# Altium schematic sheet 28pins_schematic.SchDoc (part 1 of 3)
size A2
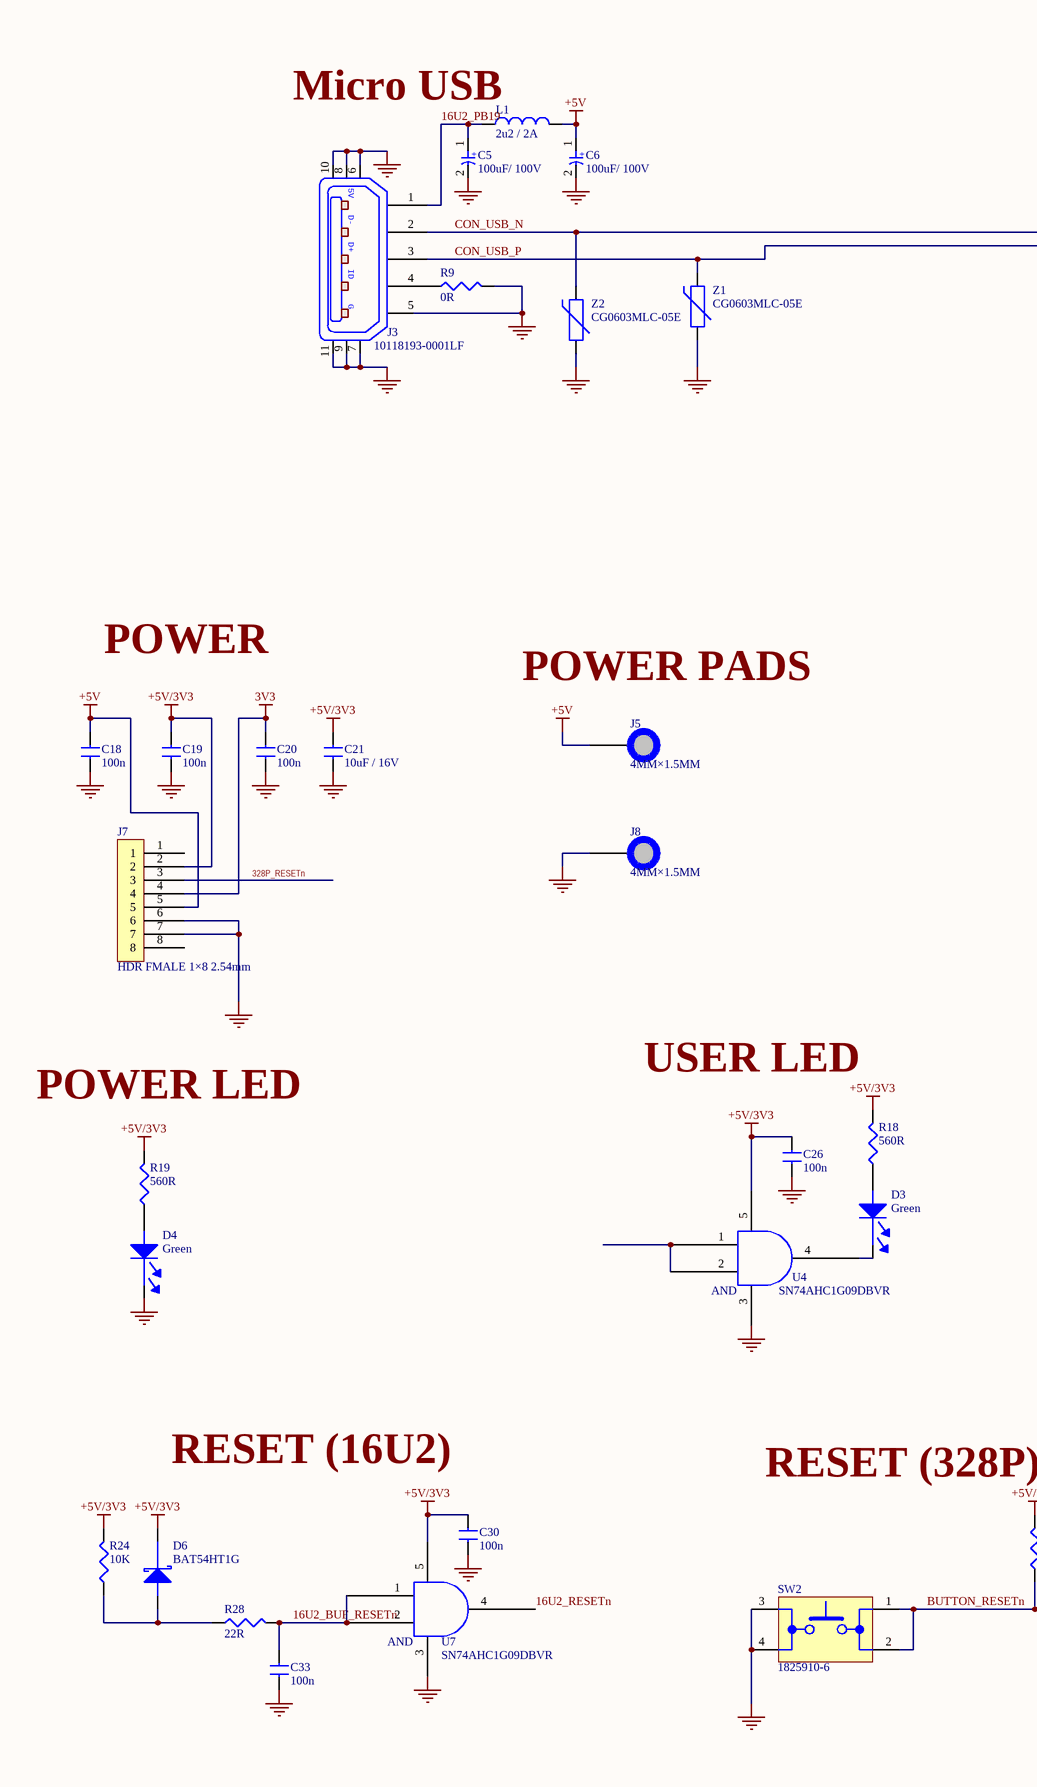
[diagram p0: 28pins_schematic.SchDoc, left]
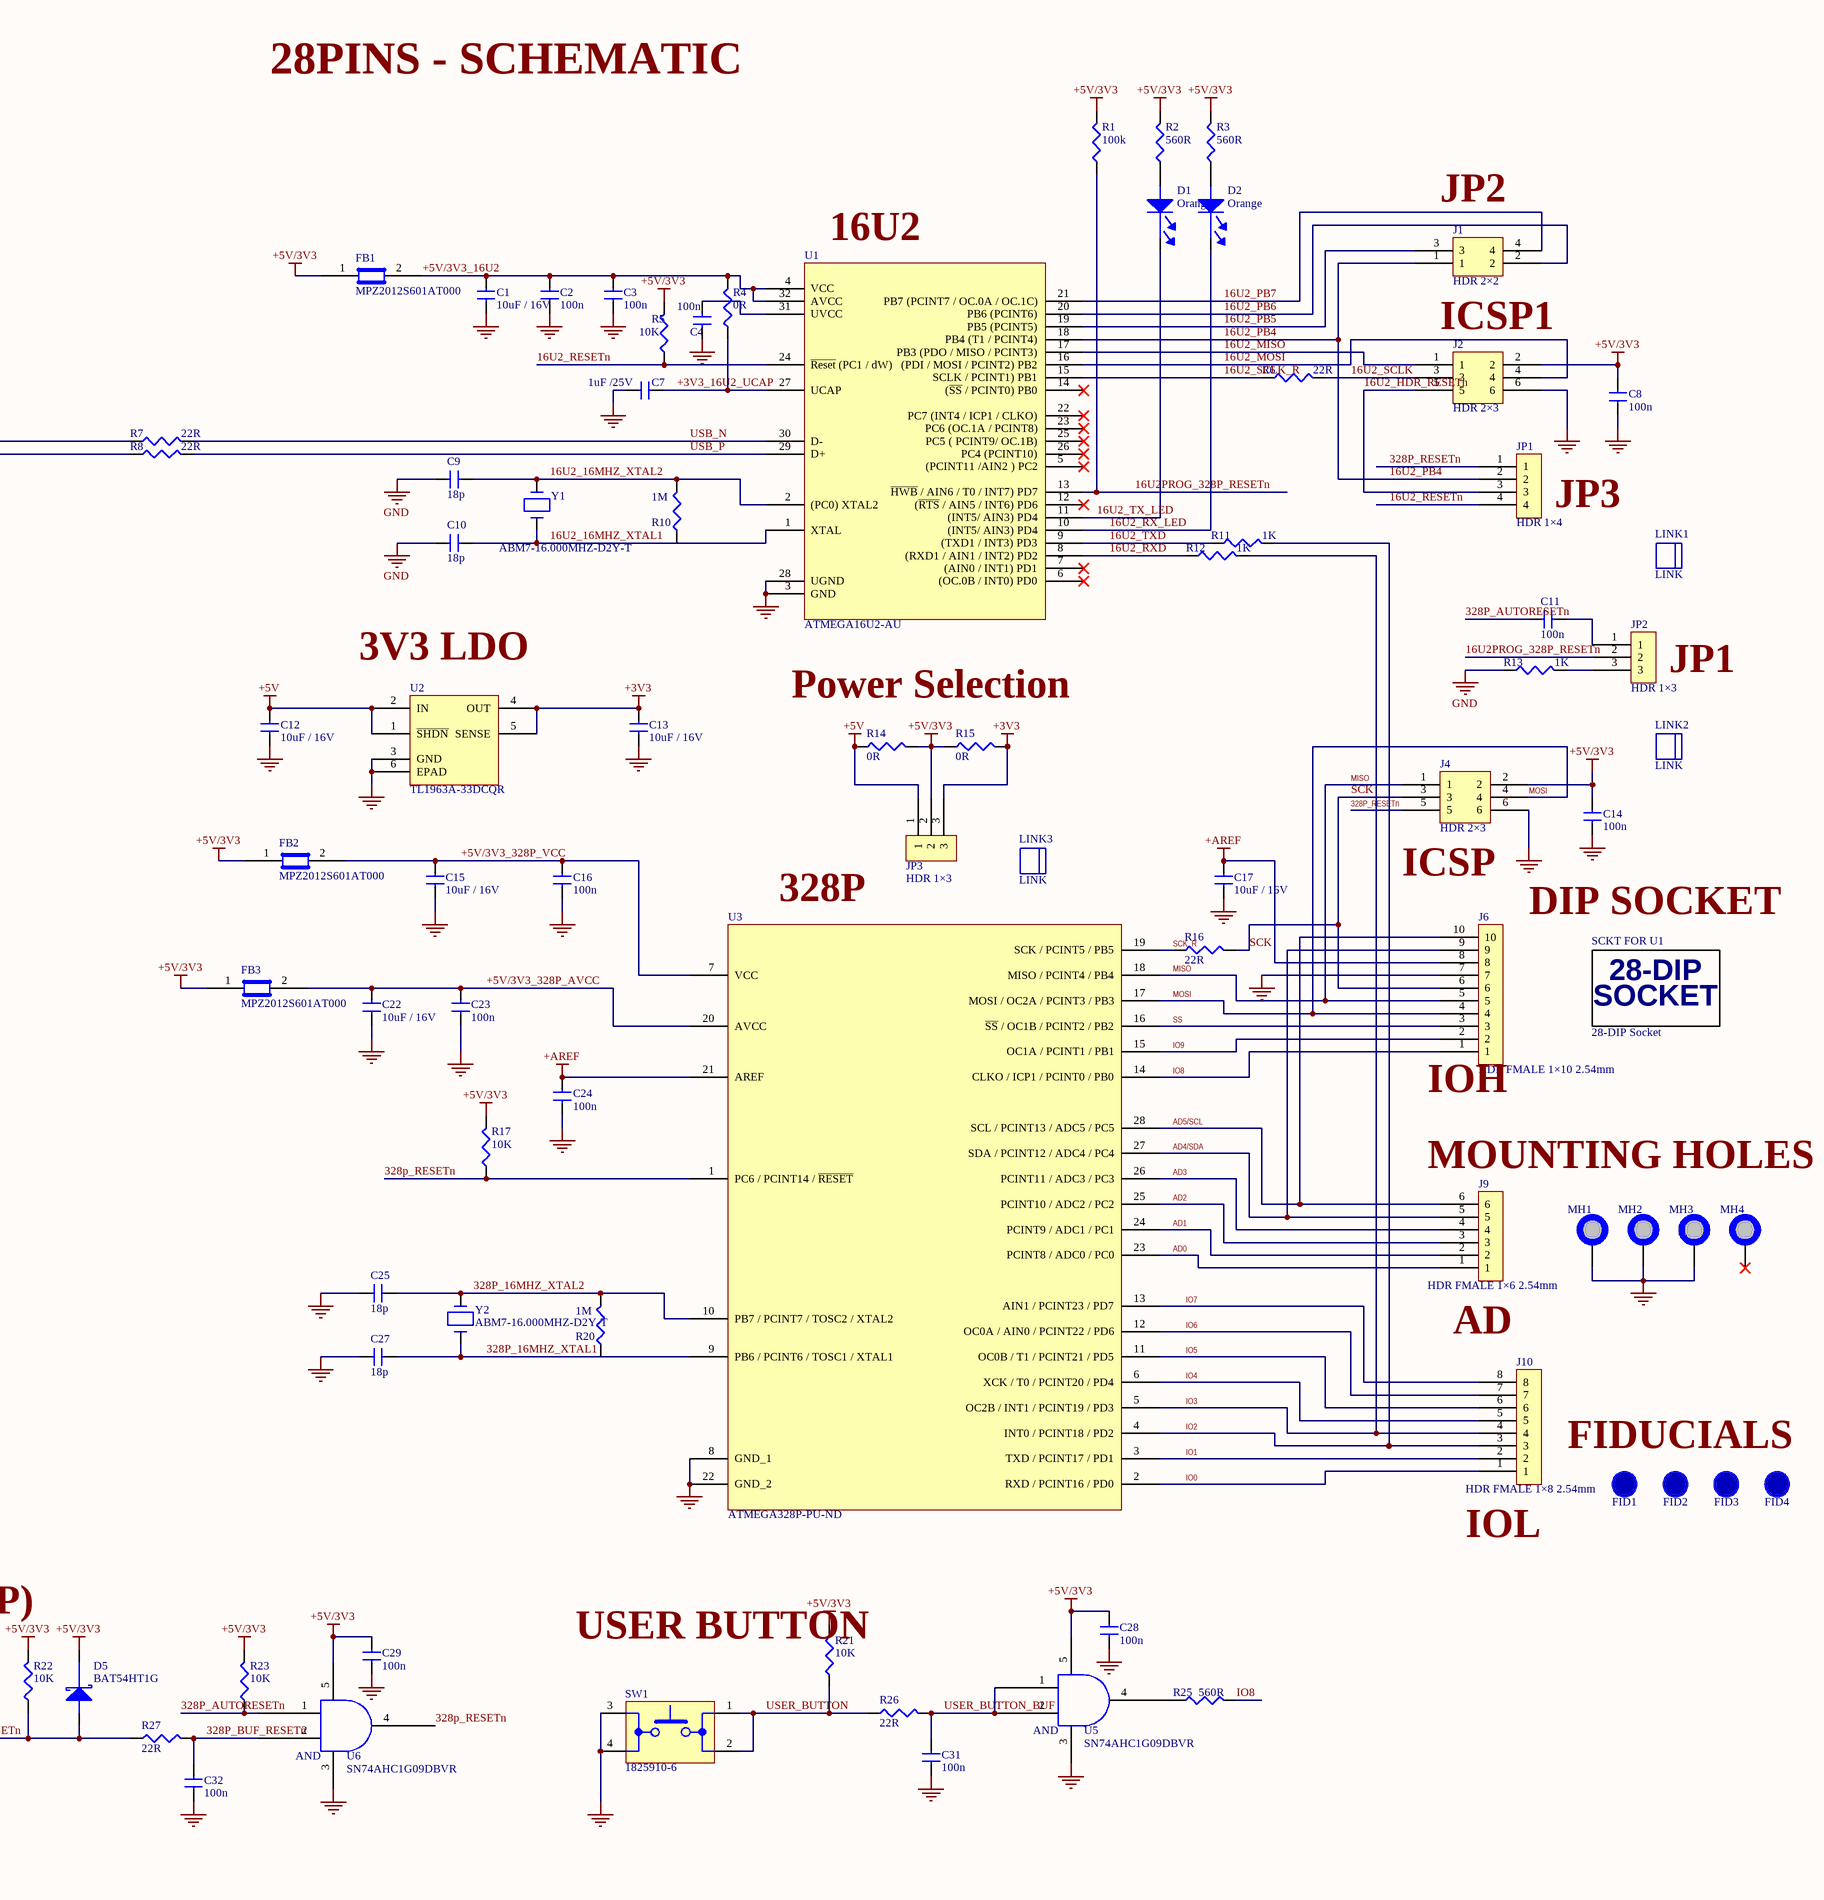
[diagram p1: 28pins_schematic.SchDoc, right]

## Parts
C1  10uF / 16V  [C0805]
C2  100n  [C0805]
C3  100n  [C0805]
C4  100n  [C0805]
C5  100uF/ 100V  [C_ALU_C_SIZE]
C6  100uF/ 100V  [C_ALU_C_SIZE]
C7  1uF /25V  [C0805]
C8  100n  [C0805]
C9  18p  [C0805]
C10  18p  [C0805]
C11  100n  [C0805]
C12  10uF / 16V  [C0805]
C13  10uF / 16V  [C0805]
C14  100n  [C0805]
C15  10uF / 16V  [C0805]
C16  100n  [C0805]
C17  10uF / 16V  [C0805]
C18  100n  [C0805]
C19  100n  [C0805]
C20  100n  [C0805]
C21  10uF / 16V  [C0805]
C22  10uF / 16V  [C0805]
C23  100n  [C0805]
C24  100n  [C0805]
C25  18p  [C0805]
C26  100n  [C0805]
C27  18p  [C0805]
C28  100n  [C0805]
C29  100n  [C0805]
C30  100n  [C0805]
C31  100n  [C0805]
C32  100n  [C0805]
C33  100n  [C0805]
D1  Orange  [LED_0603]
D2  Orange  [LED_0603]
D3  Green  [LED_0603]
D4  Green  [LED_0603]
D5  BAT54HT1G  [SOD323]
D6  BAT54HT1G  [SOD323]
FB1  MPZ2012S601AT000  [C0805]
FB2  MPZ2012S601AT000  [C0805]
FB3  MPZ2012S601AT000  [C0805]
FID1  FID_1MMC  [FID_40×120D]  (value not drawn)  (no BOM)
FID2  FID_1MMC  [FID_40×120D]  (value not drawn)  (no BOM)
FID3  FID_1MMC  [FID_40×120D]  (value not drawn)  (no BOM)
FID4  FID_1MMC  [FID_40×120D]  (value not drawn)  (no BOM)
J1  HDR 2×2  [HDR_2×2_2.54mm]
J2  HDR 2×3  [HDR_2×3_2.54mm]
J3  10118193-0001LF  [10118193]
J4  HDR 2×3  [HDR_2×3_2.54mm]
J5  4MM×1.5MM  [PAD_WITH_HOLE_4MM×1.5MM]  (no BOM)
J6  HDR FMALE 1×10 2.54mm  [Hdr_Female_1×10_2.54mm]
J7  HDR FMALE 1×8 2.54mm  [Hdr_Female_1×8_2.54mm]
J8  4MM×1.5MM  [PAD_WITH_HOLE_4MM×1.5MM]  (no BOM)
J9  HDR FMALE 1×6 2.54mm  [Hdr_Female_1×6_2.54mm]
J10  HDR FMALE 1×8 2.54mm  [Hdr_Female_1×8_2.54mm]
JP1  HDR 1×4  [HDR_1×4_2.54MM]
JP2  HDR 1×3  [HDR_1×3_2.54mm]
JP3  HDR 1×3  [HDR_1×3_2.54mm]
L1  2u2 / 2A  [C120_IND]
LINK1  LINK  (mechanical)
LINK2  LINK  (mechanical)
LINK3  LINK  (mechanical)
MH1  MH_7.4MMC_3.2MMD  [MH_7.4MMD_3.2MMD]  (value not drawn)  (no BOM)
MH2  MH_7.4MMC_3.2MMD  [MH_7.4MMD_3.2MMD]  (value not drawn)  (no BOM)
MH3  MH_7.4MMC_3.2MMD  [MH_7.4MMD_3.2MMD]  (value not drawn)  (no BOM)
MH4  MH_7.4MMNC_3.2MMD  [MH_7.4MMD_3.2MMD_NON_COPPER_NPTH]  (value not drawn)  (no BOM)
R1  100k  [R0805]
R2  560R  [R0805]
R3  560R  [R0805]
R4  0R  [R0805]
R5  10K  [R0805]
R6  22R  [R0805]
R7  22R  [R0805]
R8  22R  [R0805]
R9  0R  [R0805]
R10  1M  [R0805]
R11  1K  [R0805]
R12  1K  [R0805]
R13  1K  [R0805]
R14  0R  [R0805]
R15  0R  [R0805]
R16  22R  [R0805]
R17  10K  [R0805]
R18  560R  [R0805]
R19  560R  [R0805]
R20  1M  [R0805]
R21  10K  [R0805]
R22  10K  [R0805]
R23  10K  [R0805]
R24  10K  [R0805]
R25  560R  [R0805]
R26  22R  [R0805]
R27  22R  [R0805]
R28  22R  [R0805]
SCKT_FOR_U1  28-DIP Socket  [28_DIP_7.62mm_SOCKET]
SW1  1825910-6  [1825910-6]
SW2  1825910-6  [1825910-6]
U1  ATMEGA16U2-AU  [TQFP32]
U2  TL1963A-33DCQR  [DCQ (R-PDSO-G6)]
U3  ATMEGA328P-PU-ND  [28_DIP_7.62mm]
U4  SN74AHC1G09DBVR  [DBV_SOT_23_5]
U5  SN74AHC1G09DBVR  [DBV_SOT_23_5]
U6  SN74AHC1G09DBVR  [DBV_SOT_23_5]
U7  SN74AHC1G09DBVR  [DBV_SOT_23_5]
Y1  ABM7-16.000MHZ-D2Y-T  [ABM7_v1_BIG]
Y2  ABM7-16.000MHZ-D2Y-T  [ABM7_v1_BIG]
Z1  CG0603MLC-05E  [R0603]
Z2  CG0603MLC-05E  [R0603]

## Nets
3V3: C20.2 J7.4
+3V3: C13.2 JP3.3 R15.2 U2.4(OUT) U2.5(SENSE)
+5V: C6.1 C12.2 C18.2 J5.1 J7.5 JP3.1 L1.2 R14.1 U2.1(~{SHDN}) U2.2(IN)
+5V/3V3: C8.2 C14.2 C19.2 C21.2 C26.2 C28.2 C29.2 C30.2 D5.1(Cathode) D6.1(Cathode) FB1.1 FB2.1 FB3.1 J2.2 J4.2 J7.2 JP3.2 R1.2 R2.2 R3.2 R5.2 R14.2 R15.1 R17.2 R18.2 R19.2 R21.2 R22.2 R23.2 R24.2 U4.5 U5.5 U6.5 U7.5
+AREF: C17.2 C24.1 J6.8 U3.21(AREF)
GND: C1.1 C2.1 C3.1 C4.1 C5.2 C6.2 C7.1 C8.1 C9.1 C10.1 C12.1 C13.1 C14.1 C15.1 C16.1 C17.1 C18.1 C19.1 C20.1 C21.1 C22.2 C23.2 C24.2 C25.1 C26.1 C27.1 C28.1 C29.1 C30.1 C31.1 C32.1 C33.1 D4.1(Cathode) J2.6 J3.6 J3.7 J3.8 J3.9 J3.10 J3.11 J4.6 J6.7 J7.6 J7.7 J8.1 MH1.1 MH2.1 MH3.1 R9.2 R13.1 SW1.3 SW1.4 SW2.3 SW2.4 U1.3(GND) U1.28(UGND) U2.3(GND) U2.6(EPAD) U3.8(GND_1) U3.22(GND_2) U4.3 U5.3 U6.3 U7.3 Z1.1 Z2.1
16U2_16MHZ_XTAL1: C10.2 U1.1(XTAL) Y1.1
16U2_16MHZ_XTAL2: C9.2 R10.2 U1.2((PC0)_XTAL2) Y1.?1
16U2_BUF_RESETn: C33.2 R28.2 U7.1 U7.2
16U2_HDR_RESETn: J2.5 JP1.3
16U2_MISO: J2.1 U1.17(PB3_(PDO_/_MISO_/_PCINT3))
16U2_MOSI: J2.4 U1.16((PDI_/_MOSI_/_PCINT2)_PB2)
16U2_PB4: J1.1 JP1.2 U1.18(PB4_(T1_/_PCINT4))
16U2_PB5: J1.3 U1.19(PB5_(PCINT5))
16U2_PB6: J1.2 U1.20(PB6_(PCINT6))
16U2_PB7: J1.4 U1.21(PB7_(PCINT7_/_OC.0A_/_OC.1C))
16U2_PB19: C5.1 L1.1
16U2_RESETn: JP1.4 R5.1 U1.24(~{Reset}_(PC1_/_dW)) U7.4
16U2_RX_LED: D2.1(Cathode) U1.10((INT5/_AIN3)_PD4)
16U2_RXD: R12.1 U1.8((RXD1_/_AIN1_/_INT2)_PD2)
16U2_SCLK: J2.3 R6.2
16U2_SCLK_R: R6.1 U1.15(SCLK_/_PCINT1)_PB1)
16U2_TX_LED: D1.1(Cathode) U1.11((INT5/_AIN3)_PD4)
16U2_TXD: R11.1 U1.9((TXD1_/_INT3)_PD3)
16U2PROG_328P_RESETn: JP2.2 R1.1 U1.13(~{HWB}_/_AIN6_/_T0_/_INT7)_PD7)
328P_16MHZ_XTAL1: C27.2 U3.9(PB6_/_PCINT6_/_TOSC1_/_XTAL1) Y2.1
328P_16MHZ_XTAL2: C25.2 R20.2 U3.10(PB7_/_PCINT7_/_TOSC2_/_XTAL2) Y2.?1
328P_AUTORESETn: C11.1 R23.1 U6.1
328P_BUF_RESETn: C32.2 R27.2 U6.2
328P_RESETn: J4.5 J7.3 JP1.1 R17.1 U3.1(PC6_/_PCINT14_/_~{RESET}) U6.4
+3V3_16U2_UCAP: C7.2 R4.1 U1.27(UCAP)
+5V/3V3_16U2: C1.2 C2.2 C3.2 FB1.2 R4.2 U1.4(VCC) U1.32(AVCC)
+5V/3V3_328P_AVCC: C22.1 C23.1 FB3.2 U3.20(AVCC)
+5V/3V3_328P_VCC: C15.2 C16.2 FB2.2 U3.7(VCC)
AD0: J9.1 U3.23(PCINT8_/_ADC0_/_PC0)
AD1: J9.2 U3.24(PCINT9_/_ADC1_/_PC1)
AD2: J9.3 U3.25(PCINT10_/_ADC2_/_PC2)
AD3: J9.4 U3.26(PCINT11_/_ADC3_/_PC3)
AD4/SDA: J6.9 J9.5 U3.27(SDA_/_PCINT12_/_ADC4_/_PC4)
AD5/SCL: J6.10 J9.6 U3.28(SCL_/_PCINT13_/_ADC5_/_PC5)
BUTTON_RESETn: D5.2(Anode) R22.1 R27.1 SW2.1 SW2.2
CON_USB_N: R7.1 Z2.2
CON_USB_P: R8.1 Z1.2
IO0: J10.1 U3.2(RXD_/_PCINT16_/_PD0)
IO1: J10.2 U3.3(TXD_/_PCINT17_/_PD1)
IO2: J10.3 R11.2 U3.4(INT0_/_PCINT18_/_PD2)
IO3: J10.4 R12.2 U3.5(OC2B_/_INT1_/_PCINT19_/_PD3)
IO4: J10.5 U3.6(XCK_/_T0_/_PCINT20_/_PD4)
IO5: J10.6 U3.11(OC0B_/_T1_/_PCINT21_/_PD5)
IO6: J10.7 U3.12(OC0A_/_AIN0_/_PCINT22_/_PD6)
IO7: J10.8 U3.13(AIN1_/_PCINT23_/_PD7)
IO8: J6.1 R25.2 U3.14(CLKO_/_ICP1_/_PCINT0_/_PB0)
IO9: J6.2 U3.15(OC1A_/_PCINT1_/_PB1)
MISO: J4.1 J6.5 U3.18(MISO_/_PCINT4_/_PB4)
MOSI: J4.4 J6.4 U3.17(MOSI_/_OC2A_/_PCINT3_/_PB3)
SCK: J4.3 J6.6 R16.2
SCK_R: R16.1 U3.19(SCK_/_PCINT5_/_PB5)
SS: J6.3 U3.16(~{SS}_/_OC1B_/_PCINT2_/_PB2)
USB_N: R7.2 U1.30(D-)
USB_P: R8.2 U1.29(D+)
USER_BUTTON: R21.1 R26.1 SW1.1 SW1.2
USER_BUTTON_BUF: C31.2 R26.2 U5.1 U5.2
NetC4_2: C4.2 U1.31(UVCC)
NetC11_2: C11.2 JP2.1
NetD1_2: D1.2(Anode) R2.1
NetD2_2: D2.2(Anode) R3.1
NetD3_1: D3.1(Cathode) U4.4
NetD3_2: D3.2(Anode) R18.1
NetD4_2: D4.2(Anode) R19.1
NetD6_2: D6.2(Anode) R24.1 R28.1
NetJP2_3: JP2.3 R13.2
NetR25_1: R25.1 U5.4
NetU4_1: U4.1 U4.2

Not connected (* = marked no-connect by the designer): J3 1 2 3 4 5; J7 1 8; MH4 1*; R9 1; R10 1; R20 1; U1 5((PCINT11_/AIN2_)_PC2)* 6((OC.0B_/_INT0)_PD0)* 7((AIN0_/_INT1)_PD1)* 12((~{RTS}_/_AIN5_/_INT6)_PD6)* 14((~{SS}_/_PCINT0)_PB0)* 22(PC7_(INT4_/_ICP1_/_CLKO))* 23(PC6_(OC.1A_/_PCINT8))* 25(PC5_(_PCINT9/_OC.1B))* 26(PC4_(PCINT10))*

## Notes on the sheet
- 28PINS - SCHEMATIC
- (near U1) 16U2
- (near J1) JP2
- (near L1) Micro USB
- ICSP1
- JP3
- (near U2) 3V3 LDO
- JP1
- Power Selection
- POWER
- POWER PADS
- (near J4) ICSP
- (near U3) 328P
- DIP SOCKET
- (near J6) IOH
- (near J9) MOUNTING HOLES
- POWER LED
- USER LED
- AD
- FIDUCIALS
- (near J10) IOL
- RESET (16U2)
- (near R22) RESET (328P)
- (near R21) USER BUTTON
- (in symbol 4828-3004-CP) 28-DIP; SOCKET
- (in symbol 10118193-0001LF) 5V; D-; D+; ID; G
- (in symbol EEE-1AA101WR) +
- (in symbol SN74AHC1G09DBVR) AND